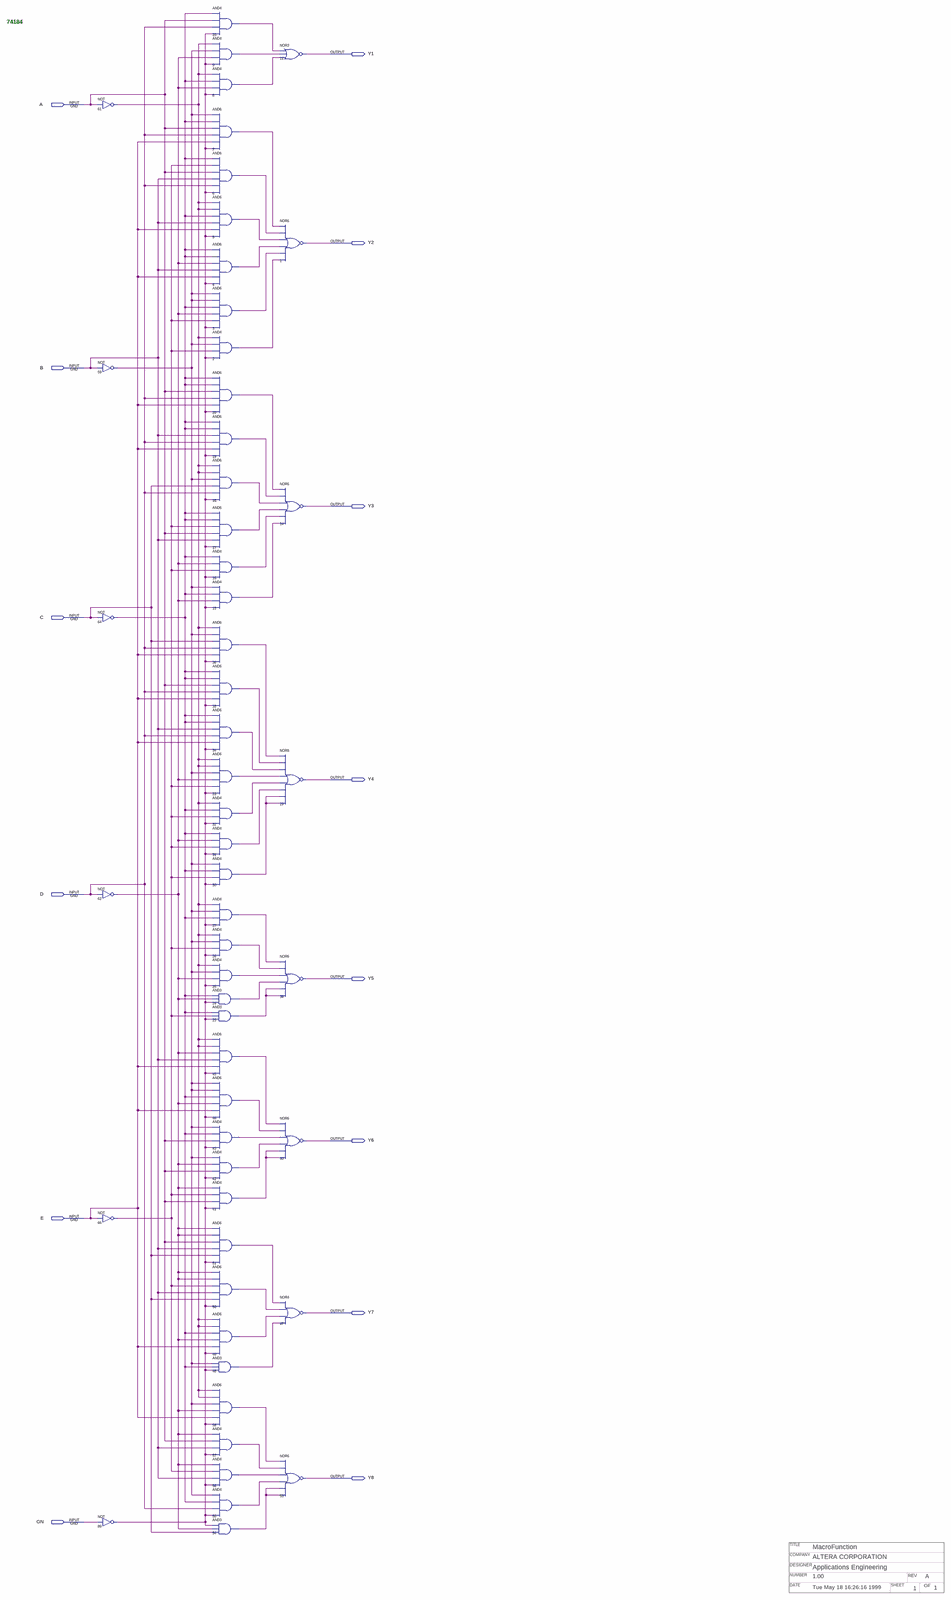
[diagram p0: schematic sheet, whole]
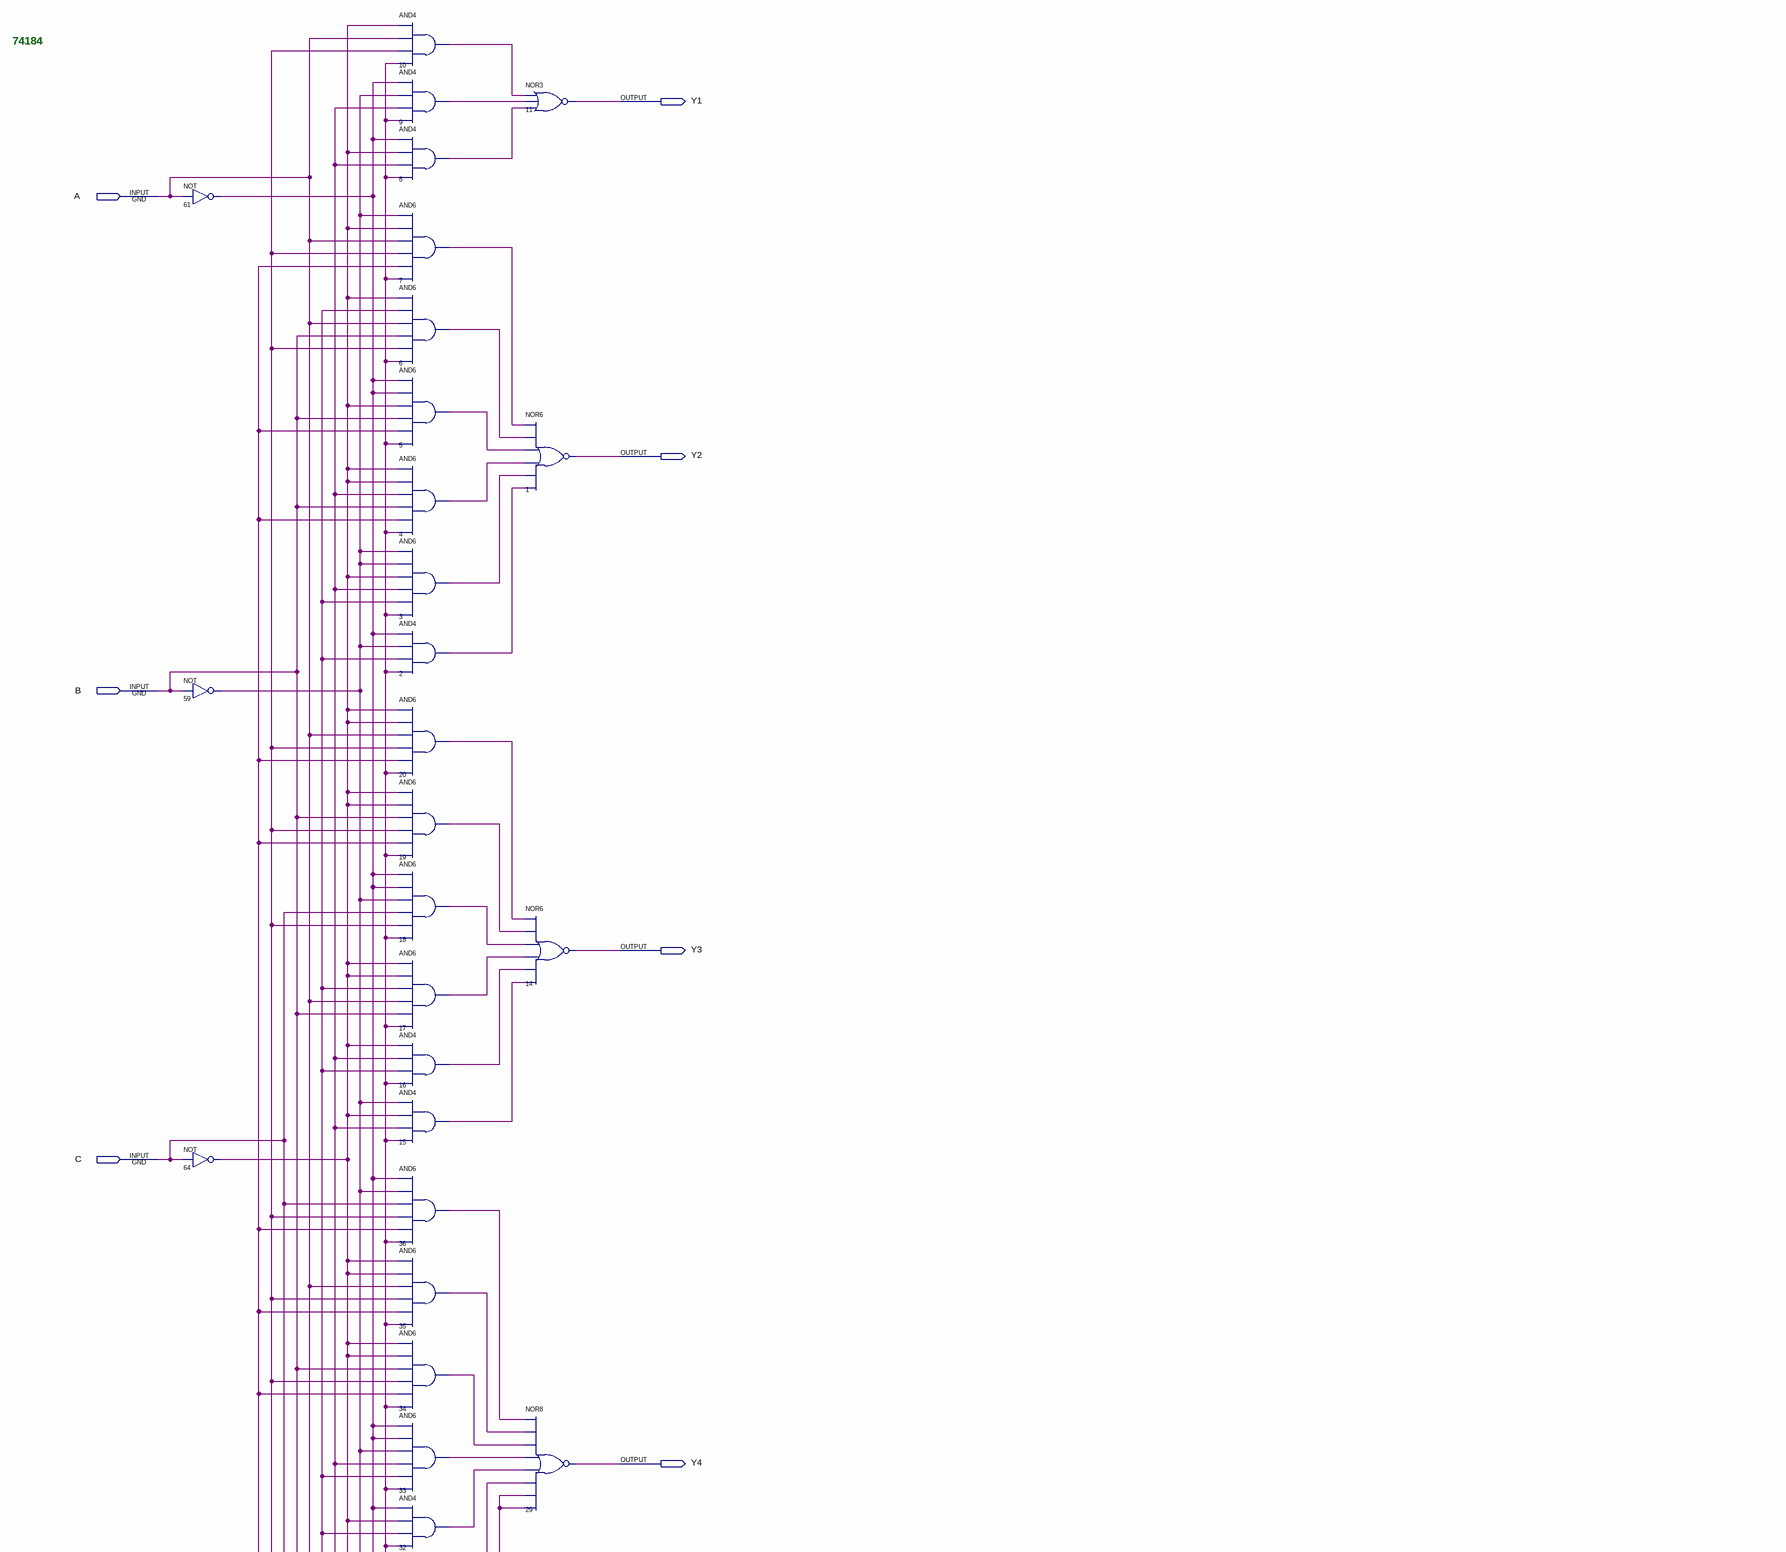
[diagram p1: schematic sheet, upper part]
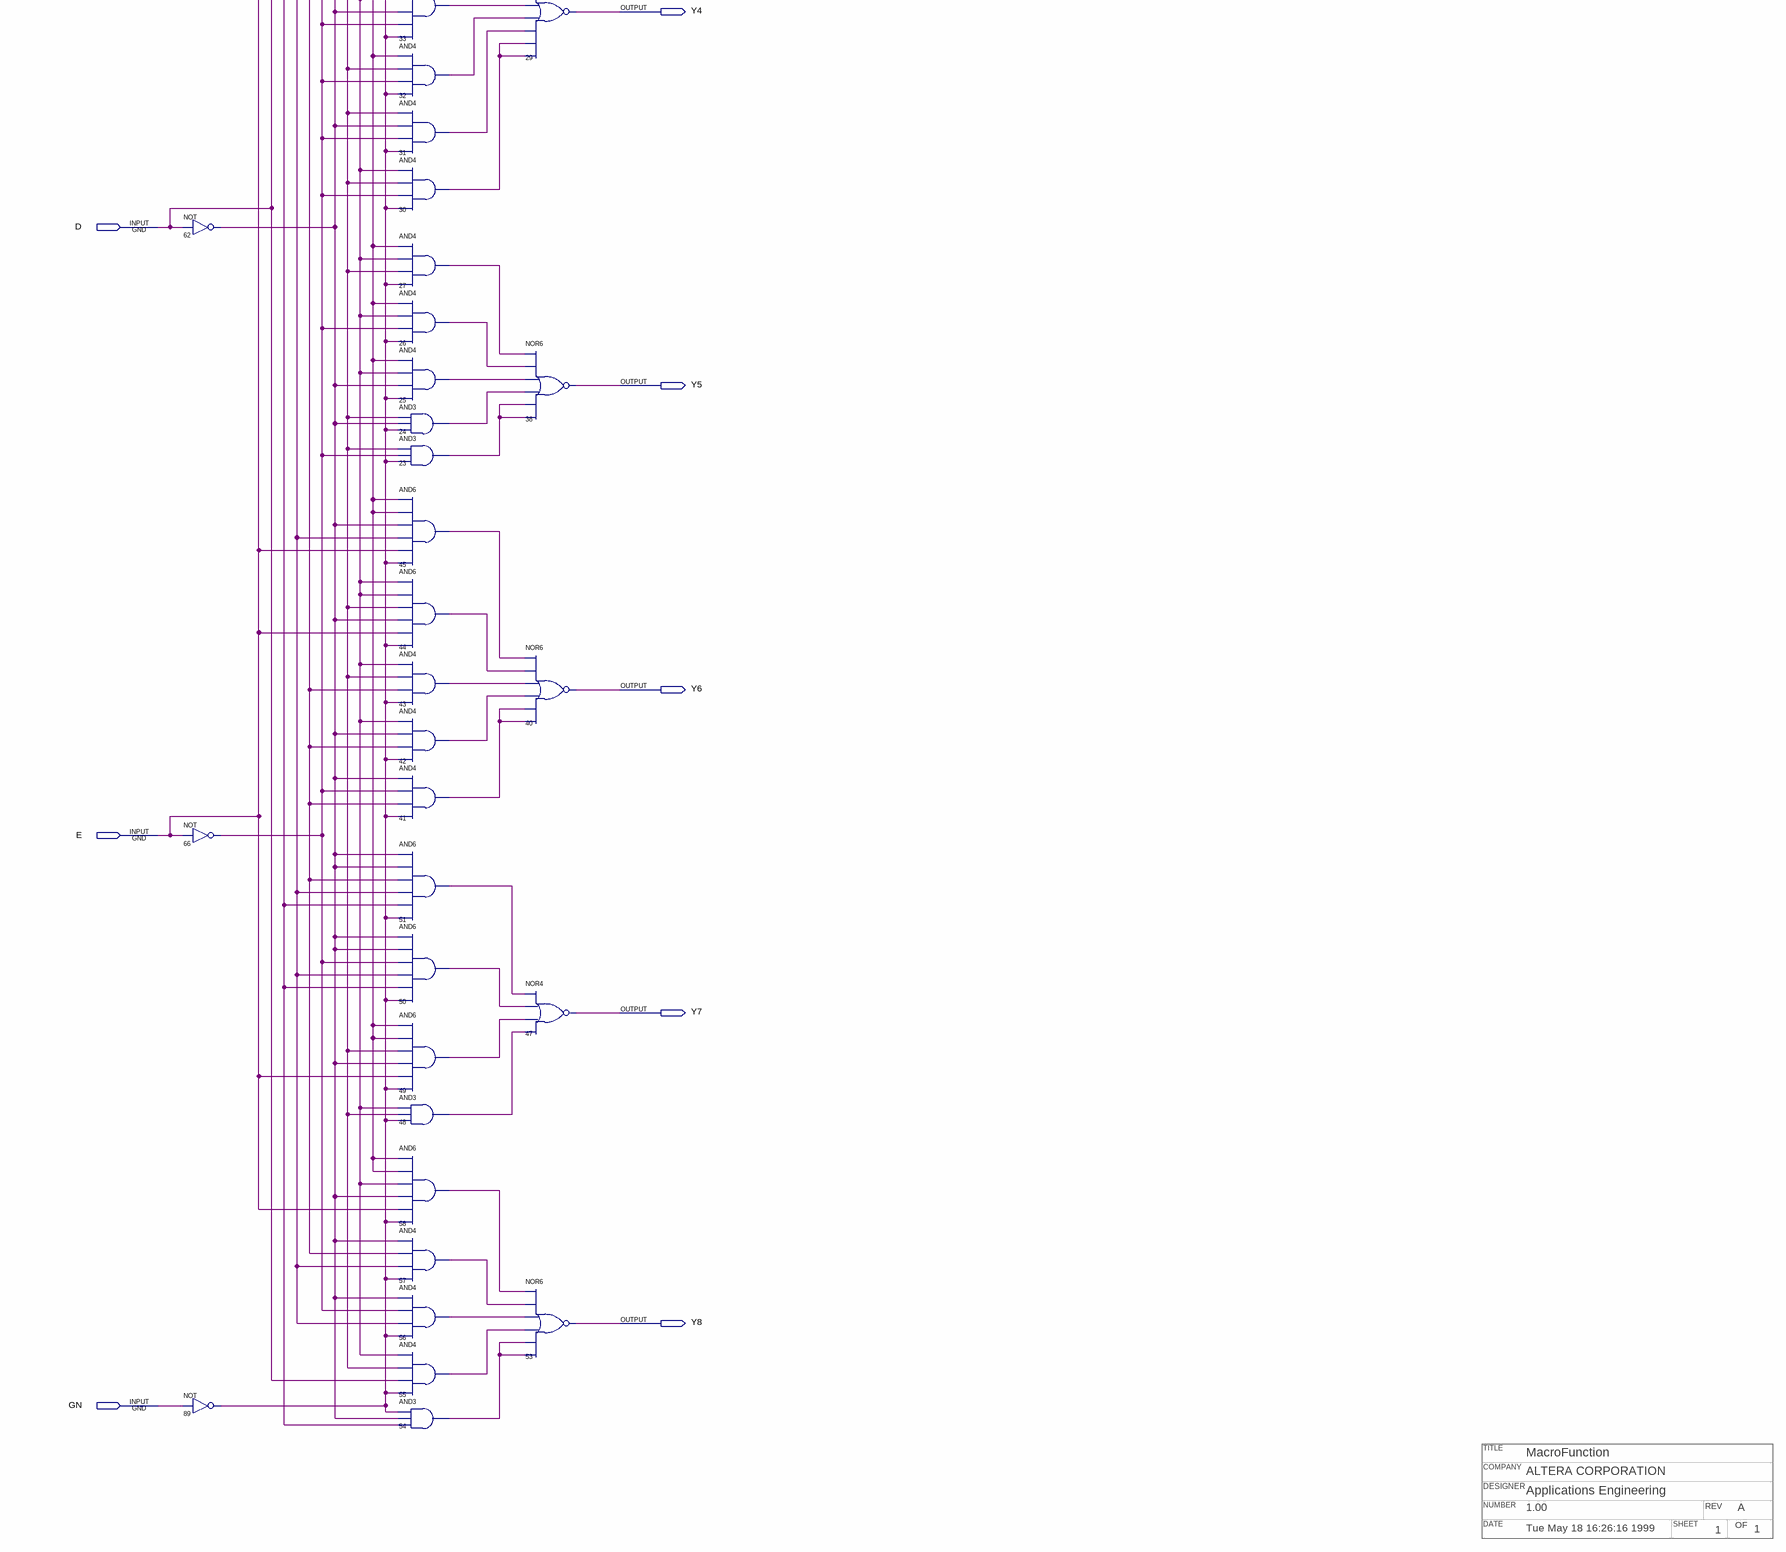
[diagram p2: schematic sheet, lower part]
// Quartus schematic 74184.bdf as structural Verilog: 55 symbols, 14 pins
// Title block: TITLE: MacroFunction; COMPANY: ALTERA CORPORATION; DESIGNER: Applications Engineering; NUMBER: 1.00; REV: A; DATE: Tue May 18 16:26:16 1999; SHEET: 1; OF: 1
module \74184  (
  input  A,
  input  B,
  input  C,
  input  D,
  input  E,
  input  GN,
  output Y1,
  output Y2,
  output Y3,
  output Y4,
  output Y5,
  output Y6,
  output Y7,
  output Y8
);

  wire n2_out, n3_out, n4_out, n5_out, n6_out, n7_out, n8_out, n9_out, n10_out, n15_out, n16_out, n17_out,
       n18_out, n19_out, n20_out, n23_out, n24_out, n25_out, n26_out, n27_out, n30_out, n31_out, n32_out,
       n33_out, n34_out, n35_out, n36_out, n41_out, n42_out, n43_out, n44_out, n45_out, n48_out, n49_out,
       n50_out, n51_out, n54_out, n55_out, n56_out, n57_out, n58_out, n59_out, n61_out, n62_out, n64_out,
       n66_out, n89_out;

  not u_61 (n61_out, A);
  not u_59 (n59_out, B);
  not u_64 (n64_out, C);
  not u_62 (n62_out, D);
  not u_66 (n66_out, E);
  not u_89 (n89_out, GN);
  and u_10 (n10_out, n64_out, A, D, n89_out);
  and u_9 (n9_out, n61_out, n59_out, n62_out, n89_out);
  and u_8 (n8_out, n61_out, n64_out, n62_out, n89_out);
  and u_7 (n7_out, n59_out, n64_out, A, D, E, n89_out);
  and u_6 (n6_out, n64_out, n66_out, A, B, D, n89_out);
  and u_5 (n5_out, n61_out, n61_out, n64_out, B, E, n89_out);
  and u_4 (n4_out, n64_out, n64_out, n62_out, B, E, n89_out);
  and u_3 (n3_out, n59_out, n59_out, n64_out, n62_out, n66_out, n89_out);
  and u_2 (n2_out, n61_out, n59_out, n66_out, n89_out);
  and u_20 (n20_out, n64_out, n64_out, A, D, E, n89_out);
  and u_19 (n19_out, n64_out, n64_out, B, D, E, n89_out);
  and u_18 (n18_out, n61_out, n61_out, n59_out, C, D, n89_out);
  and u_17 (n17_out, n64_out, n64_out, n66_out, A, B, n89_out);
  and u_16 (n16_out, n64_out, n62_out, n66_out, n89_out);
  and u_15 (n15_out, n59_out, n64_out, n62_out, n89_out);
  and u_36 (n36_out, n61_out, n59_out, C, D, E, n89_out);
  and u_35 (n35_out, n64_out, n64_out, A, D, E, n89_out);
  and u_34 (n34_out, n64_out, n64_out, B, D, E, n89_out);
  and u_33 (n33_out, n61_out, n61_out, n59_out, n62_out, n66_out, n89_out);
  and u_32 (n32_out, n61_out, n64_out, n66_out, n89_out);
  and u_31 (n31_out, n64_out, n62_out, n66_out, n89_out);
  and u_30 (n30_out, n59_out, n64_out, n66_out, n89_out);
  and u_27 (n27_out, n61_out, n59_out, n64_out, n89_out);
  and u_26 (n26_out, n61_out, n59_out, n66_out, n89_out);
  and u_25 (n25_out, n61_out, n59_out, n62_out, n89_out);
  and u_24 (n24_out, n64_out, n62_out, n89_out);
  and u_23 (n23_out, n64_out, n66_out, n89_out);
  and u_45 (n45_out, n61_out, n61_out, n62_out, B, E, n89_out);
  and u_44 (n44_out, n59_out, n59_out, n64_out, n62_out, E, n89_out);
  and u_43 (n43_out, n59_out, n64_out, A, n89_out);
  and u_42 (n42_out, n59_out, n62_out, A, n89_out);
  and u_41 (n41_out, n62_out, n66_out, A, n89_out);
  and u_51 (n51_out, n62_out, n62_out, A, B, C, n89_out);
  and u_50 (n50_out, n62_out, n62_out, n66_out, B, C, n89_out);
  and u_49 (n49_out, n61_out, n61_out, n64_out, n62_out, E, n89_out);
  and u_48 (n48_out, n59_out, n64_out, n89_out);
  and u_58 (n58_out, n61_out, n61_out, n59_out, n62_out, E, n89_out);
  and u_57 (n57_out, n62_out, A, B, n89_out);
  and u_56 (n56_out, n62_out, n66_out, B, n89_out);
  and u_55 (n55_out, n59_out, n64_out, D, n89_out);
  and u_54 (n54_out, n89_out, n62_out, C);
  nor u_11 (Y1, n10_out, n9_out, n8_out);
  nor u_1 (Y2, n7_out, n6_out, n5_out, n4_out, n3_out, n2_out);
  nor u_14 (Y3, n20_out, n19_out, n18_out, n17_out, n16_out, n15_out);
  nor u_29 (Y4, n36_out, n35_out, n34_out, n33_out, n32_out, n31_out, n30_out, n30_out);
  nor u_38 (Y5, n27_out, n26_out, n25_out, n24_out, n23_out, n23_out);
  nor u_40 (Y6, n45_out, n44_out, n43_out, n42_out, n41_out, n41_out);
  nor u_47 (Y7, n51_out, n50_out, n49_out, n48_out);
  nor u_53 (Y8, n58_out, n57_out, n56_out, n55_out, n54_out, n54_out);

  // Notes on the sheet:
  //   74184
endmodule
